# EAGLE design Power.Board (EAGLE 8.4.1)
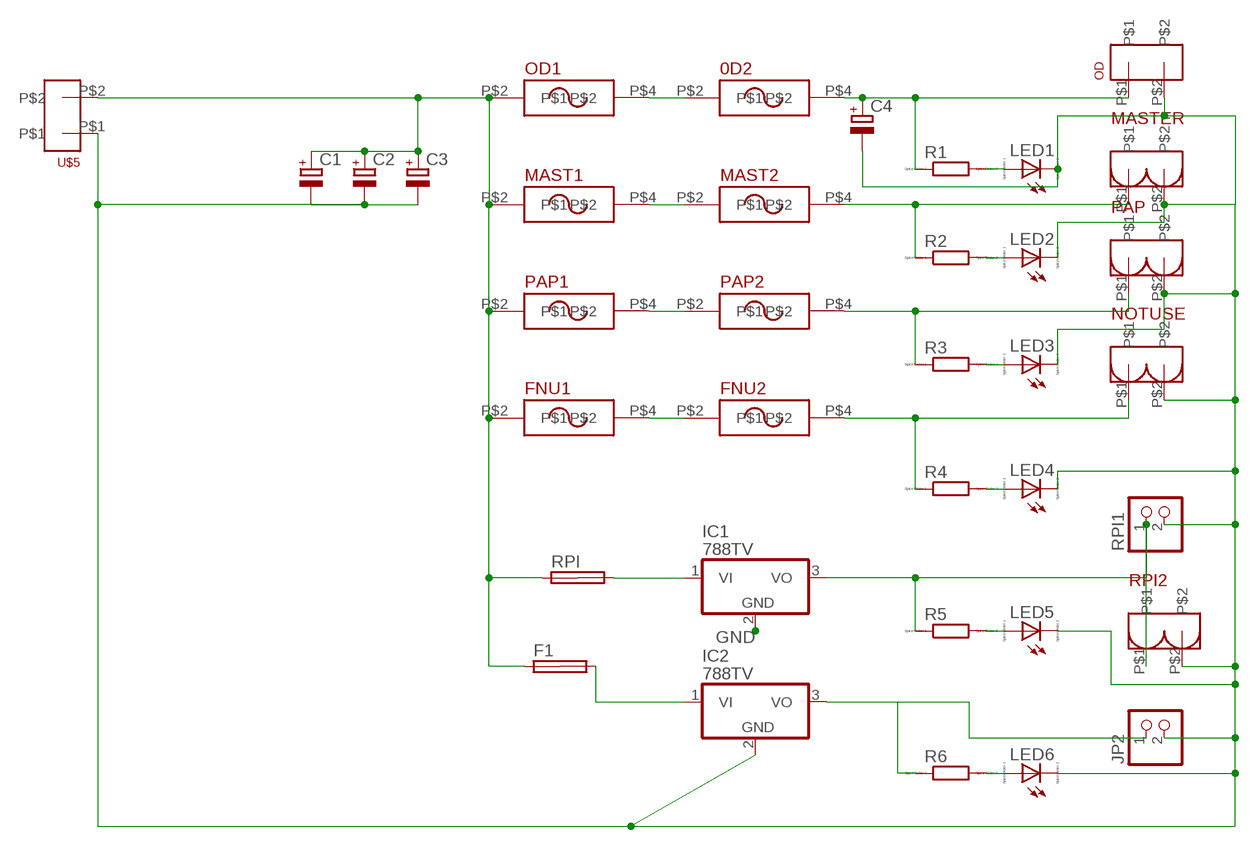
[diagram p0: schematic, sheet 1]

## Parts
0D2  AUTO_FUSE  [AUTO_FUSE]
C1  CPOL-EUE7.5-18  [E7,5-18]
C2  CPOL-EUE7.5-18  [E7,5-18]
C3  CPOL-EUE7.5-18  [E7,5-18]
C4  CPOL-EUE5-13  [E5-13]
F1  SHK20L  [SHK20L]
FNU1  AUTO_FUSE  [AUTO_FUSE]
FNU2  AUTO_FUSE  [AUTO_FUSE]
IC1  788TV  [TO220V]
IC2  788TV  [TO220V]
JP2  PINHD-1X2  [1X02]
LED1  LED_ELD260  [LED_LD260]
LED2  LED_ELD260  [LED_LD260]
LED3  LED_ELD260  [LED_LD260]
LED4  LED_ELD260  [LED_LD260]
LED5  LED_ELD260  [LED_LD260]
LED6  LED_ELD260  [LED_LD260]
MAST1  AUTO_FUSE  [AUTO_FUSE]
MAST2  AUTO_FUSE  [AUTO_FUSE]
MASTER  GREEN_HEADER  [GREEN_HEADER]
NOTUSE  GREEN_HEADER  [GREEN_HEADER]
OD  3MM_HEADER_2  [3MM_HEADER_2]
OD1  AUTO_FUSE  [AUTO_FUSE]
PAP  GREEN_HEADER  [GREEN_HEADER]
PAP1  AUTO_FUSE  [AUTO_FUSE]
PAP2  AUTO_FUSE  [AUTO_FUSE]
R1  R0207/10  [0207/10]
R2  R0207/10  [0207/10]
R3  R0207/10  [0207/10]
R4  R0207/10  [0207/10]
R5  R0207/10  [0207/10]
R6  R0207/10  [0207/10]
RPI  SHK20L  [SHK20L]
RPI1  PINHD-1X2  [1X02]
RPI2  GREEN_HEADER  [GREEN_HEADER]
U$5  3MM_HEADER_2  [3MM_HEADER_2]

## Nets
12V: C1.+ C2.+ C3.+ F1.1A FNU1.P$2 MAST1.P$2 OD1.P$2 PAP1.P$2 RPI.1A U$5.P$2
GND: C1.- C2.- C3.- C4.- IC1.2(GND) IC2.2(GND) JP2.2 LED1.K(C) LED2.K(C) LED3.K(C) LED4.K(C) LED5.K(C) LED6.K(C) MASTER.P$2 NOTUSE.P$2 OD.P$2 PAP.P$2 RPI1.2 RPI2.P$2 U$5.P$1
N$1: PAP2.P$4 PAP.P$1 R3.1
N$2: 0D2.P$2 OD1.P$4
N$3: MAST1.P$4 MAST2.P$2
N$4: PAP1.P$4 PAP2.P$2
N$5: IC1.1(VI) RPI.2A
N$6: 0D2.P$4 C4.+ OD.P$1 R1.1
N$7: MAST2.P$4 MASTER.P$1 R2.1
N$8: IC1.3(VO) R5.1 RPI1.1 RPI2.P$1
N$9: IC2.3(VO) JP2.1 R6.1
N$10: FNU1.P$4 FNU2.P$2
N$11: FNU2.P$4 NOTUSE.P$1 R4.1
N$12: LED1.A R1.2
N$13: LED2.A R2.2
N$14: LED3.A R3.2
N$15: LED4.A R4.2
N$16: LED5.A R5.2
N$17: LED6.A R6.2
N$18: F1.2A IC2.1(VI)
Unconnected: F1.1B F1.2B RPI.1B RPI.2B

## Library data of the parts
0D2 FNU1 FNU2 MAST1 MAST2 OD1 PAP1 PAP2 = AUTO_FUSE:AUTO_FUSE
C1-C4 = rcl:CPOL-EU: POLARIZED CAPACITOR, European symbol
F1 RPI = fuse:SHK20L: FUSE HOLDER 5 x 20 mm, SH contact, SHH1 Schukat, E1073 Buerklin; OC_FARNELL: unknown; OC_NEWARK: unknown
IC1 IC2 = linear:78*: Positive VOLTAGE REGULATOR Source: http://cache.national.com/ds/LM/LM78L05.pdf http://www.fairchildsemi.com/ds/LM/LM7805.pdf
JP2 RPI1 = pinhead:PINHD-1X2: PIN HEADER
LED1-LED6 = eagle-ltspice:LED_E: LED Source: http://www.osram.convergy.de Source: www.luxeon.com Source: www.kingbright.com; SPICEMODEL: NONE; SPICEPREFIX: D; SPICETYPE: diode
MASTER NOTUSE PAP RPI2 = PowerHeaders:GREEN_HEADER: Green Connector for PCB Drill: 1.5mm Diameter: 3.81mm Pitch: 5.08mm //FCAM1
OD U$5 = PowerHeaders:3MM_HEADER_2: Drill: 3mm Diameter : 6mm Pitch: 10.16mm //FCAM1
R1-R6 = eagle-ltspice:R: RESISTOR, European symbol; SPICEMODEL: NONE; SPICEPREFIX: R

## Board
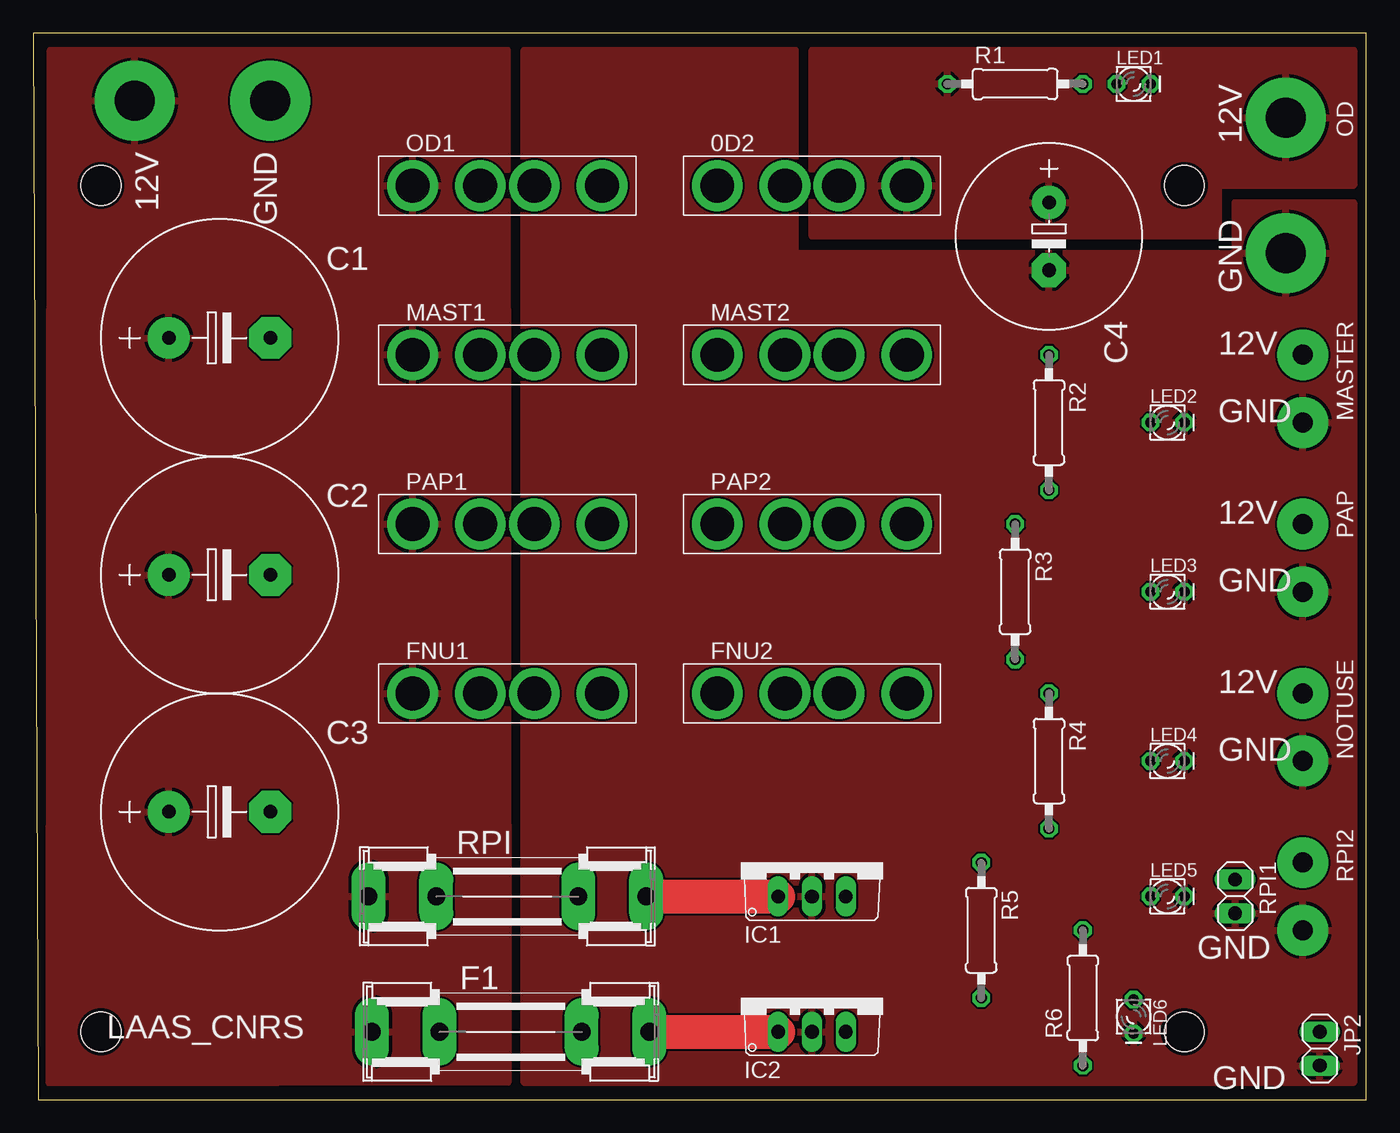
[diagram p1: board, top side]
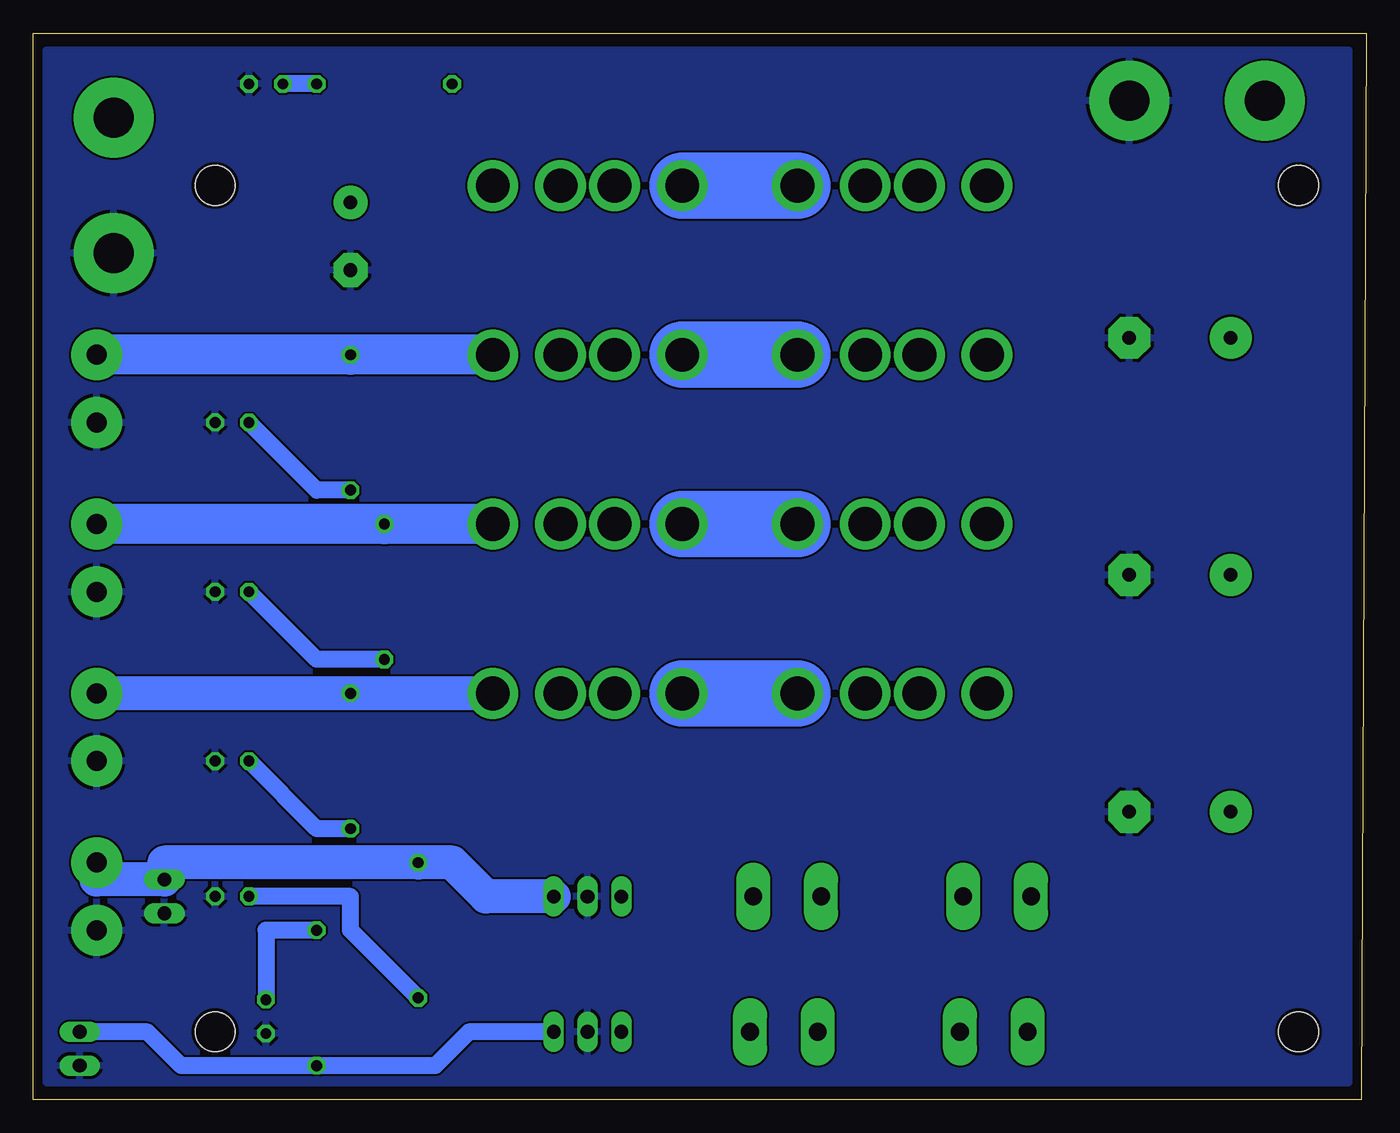
[diagram p2: board, bottom side, seen from below]

Size 100 x 80 mm. Coordinates in mm from the lower left corner, seen from the top.
Outline: 0.38,0 100,0 100,80 0,80 0.38,0
Copper layers (1*16): Top 0.035mm / dielectric 1.5mm / Bottom 0.035mm
Design rules "SeeedStudio_2layer_DRU_no_angle_20140221": minimum track width 6mil, minimum drill 12mil, track to track 6mil, track to pad 6mil, pad to pad 6mil, via to via 6mil, smd to smd 0mil, copper to edge 10mil, drill to drill 10mil, minimum pad ring 10mil, minimum via ring 6mil, stop-mask expansion 2mil, vias tented up to drill 100mil, thermal gap 10mil

### Footprints (pad centres in the part's own frame; a part is rotated, then mirrored left to right if it is on the bottom)
AUTO_FUSE = drill 2.54 pad 3.81: P$1 -2.03,0; P$2 -7.11,0; P$3 2.03,0; P$4 7.11,0
E7,5-18 = drill 1.016 pad 3.15: + -3.81,0 | drill 1.016 pad 3.15 octagon: - 3.81,0
E5-13 = drill 1.016 pad 2.54: + -2.54,0 | drill 1.016 pad 2.54 octagon: - 2.54,0
SHK20L = drill 1.321 pad 2.54 long: 1A -10.414,0; 1B -5.334,0; 2A 10.414,0; 2B 5.334,0
TO220V = drill 1.016 long: 1 -2.54,-2.54; 2 0,-2.54; 3 2.54,-2.54
1X02 = drill 1.016 long: 1 -1.27,0; 2 1.27,0
LED_LD260 = drill 0.813 octagon: A -1.27,0; K 1.27,0
GREEN_HEADER = drill 1.5 pad 3.81: P$1 -2.54,0; P$2 2.54,0
3MM_HEADER_2 = drill 3 pad 6: P$1 0,0; P$2 10.16,0
0207/10 = drill 0.813 octagon: 1 -5.08,0; 2 5.08,0
TROUS_FIXATION = hole 3: 5.08,5.08; 5.08,68.58; 86.36,68.58; 86.36,5.08

### Placement (x,y rotation side)
0D2  58.42,68.58 0 top
C1  13.97,57.15 0 top
C2  13.97,39.37 0 top
C3  13.97,21.59 0 top
C4  76.2,64.77 270 top
F1  35.81,5.08 0 top
FNU1  35.56,30.48 0 top
FNU2  58.42,30.48 0 top
IC1  58.42,17.78 0 top
IC2  58.42,7.62 0 top
JP2  96.52,3.81 270 top
LED1  82.55,76.2 0 top
LED2  85.09,50.8 0 top
LED3  85.09,38.1 0 top
LED4  85.09,25.4 0 top
LED5  85.09,15.24 0 top
LED6  82.55,6.22 270 top
MAST1  35.56,55.88 0 top
MAST2  58.42,55.88 0 top
MASTER  95.25,53.34 270 top
NOTUSE  95.25,27.94 270 top
OD  93.98,73.66 270 top
OD1  35.56,68.58 0 top
PAP  95.25,40.64 270 top
PAP1  35.56,43.18 0 top
PAP2  58.42,43.18 0 top
R1  73.66,76.2 0 top
R2  76.2,50.8 270 top
R3  73.66,38.1 270 top
R4  76.2,25.4 270 top
R5  71.12,12.7 270 top
R6  78.74,7.62 90 top
RPI  35.56,15.24 0 top
RPI1  90.17,15.24 270 top
RPI2  95.25,15.24 270 top
U$1  [TROUS_FIXATION]  0,0 0 top
U$5  17.78,74.93 180 top

### Tracks (layer width: path | path; a pad name or v marks a point on that pad's centre or on a via)
12V
  pour Top: 1.27,78.74 35.56,78.74 35.61,1.28 1.2,1.2
GND
  pour Bottom: 1.27,78.74 99.06,78.74 99.06,1.27 1.27,1.27
  pour Top: 36.83,78.74 57.15,78.74 57.15,63.5 90.17,63.5 90.17,67.31 99.06,67.31 99.06,1.27 36.83,1.27
N$1
  Bottom 3: PAP2.P$4 R3.1 PAP.P$1
N$2
  Bottom 5: OD1.P$4 0D2.P$2
N$3
  Bottom 5: MAST1.P$4 MAST2.P$2
N$4
  Bottom 5: PAP1.P$4 PAP2.P$2
N$5
  Top 2.54: RPI.2A IC1.1
N$6
  pour Top: 58.42,78.74 99.06,78.74 99.06,68.58 88.9,68.58 88.9,64.77 58.42,64.77
N$7
  Bottom 3: MAST2.P$4 R2.1 MASTER.P$1
N$8
  Bottom 2.54: IC1.3 66.04,15.24 68.58,17.78 R5.1 90.17,17.78 RPI1.1 95.25,16.51 RPI2.P$1
N$9
  Bottom 1.27: IC2.3 67.31,5.08 69.85,2.54 R6.1 88.9,2.54 91.44,5.08 JP2.1
N$10
  Bottom 5: FNU1.P$4 FNU2.P$2
N$11
  Bottom 2.54: FNU2.P$4 R4.1 NOTUSE.P$1
N$12
  Bottom 1.27: R1.2 LED1.A
N$13
  Bottom 1.27: R2.2 78.74,45.72 LED2.A
N$14
  Bottom 1.27: R3.2 78.74,33.02 LED3.A
N$15
  Bottom 1.27: R4.2 78.74,20.32 LED4.A
N$16
  Bottom 1.27: R5.2 76.2,12.7 76.2,15.24 LED5.A
N$17
  Bottom 1.27: R6.2 82.55,12.7 LED6.A
N$18
  Top 2.54: F1.2A IC2.1

### Text on the board
tNames: 12V | 12V | GND | GND | 12V | GND | 12V | GND | 12V | GND | GND | LAAS_CNRS | GND